# Altium schematic sheet Perifericos.SchDoc
size A4; SheetNumber: 6; SheetTotal: 6
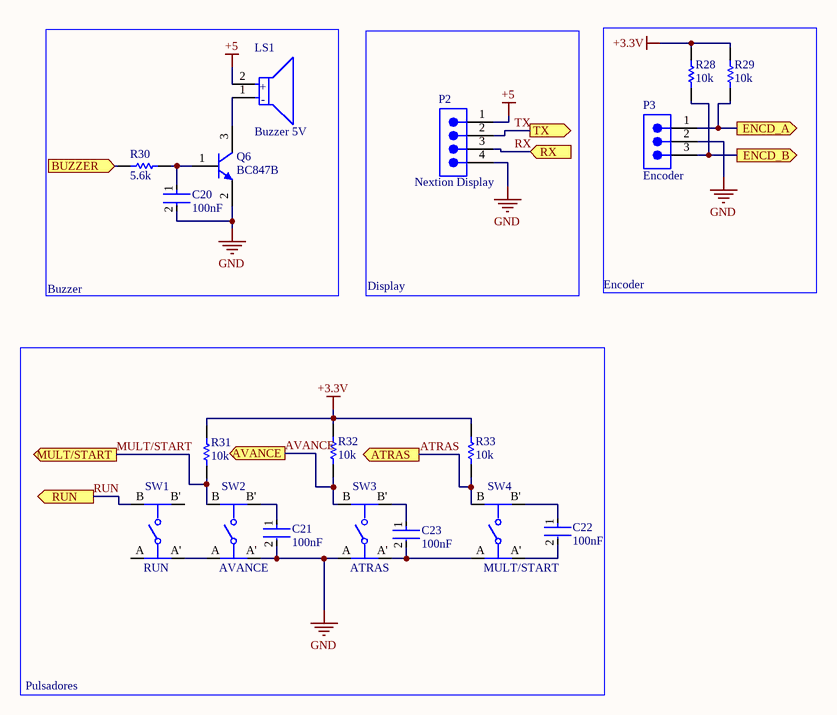
[diagram p0: Perifericos.SchDoc]

## Parts
C20  100nF  [FP-0805-L_2_01_0_2-W_1_25-IPC_B]
C21  100nF  [FP-0805-L_2_01_0_2-W_1_25-IPC_B]
C22  100nF  [FP-0805-L_2_01_0_2-W_1_25-IPC_B]
C23  100nF  [FP-0805-L_2_01_0_2-W_1_25-IPC_B]
LS1  Buzzer 5V  [FP-SDC1610M5-01-MFG]
P2  Nextion Display  [61300411121]
P3  Encoder  [61300311121]
Q6  BC847B  [INF-SOT23_M]
R28  10k  [RESC2013X50X30LL20T20]
R29  10k  [RESC2013X50X30LL20T20]
R30  5.6k  [RESC2013X50X30NL20T20]
R31  10k  [RESC2013X50X30LL20T20]
R32  10k  [RESC2013X50X30LL20T20]
R33  10k  [RESC2013X50X30LL20T20]
SW1  RUN  [FP-EVQ-PAC07K-MFG]
SW2  AVANCE  [FP-EVQ-PAC07K-MFG]
SW3  ATRAS  [FP-EVQ-PAC07K-MFG]
SW4  MULT/START  [FP-EVQ-PAC07K-MFG]

## Blocks framed on the sheet
Buzzer: C20 LS1 Q6 R30
Display: P2
Encoder: P3 R28 R29
Pulsadores: C21-C23 R31-R33 SW1-SW4

## Ports
ATRAS (out), AVANCE (out), BUZZER (in), ENCD_A (out), ENCD_B (out), MULT/START (out), RUN (out), RX (in), TX (out)

## Nets
+3.3V: R28.2 R29.2 R31.2 R32.2 R33.2
+5: LS1.2(A) P2.1
GND: C20.2 C21.2 P2.4 P3.2 Q6.2(E) SW2.A' SW3.A
ATRAS: R33.1 SW4.B ; port ATRAS
AVANCE: R32.1 SW3.B ; port AVANCE
BUZZER: R30.1 ; port BUZZER
ENCD_A: P3.1 R29.1 ; port ENCD_A
ENCD_B: P3.3 R28.1 ; port ENCD_B
MULT/START: R31.1 SW2.B ; port MULT/START
RUN: SW1.B ; port RUN
RX: P2.3 ; port RX
TX: P2.2 ; port TX
NetC20_1: C20.1 Q6.1(B) R30.2
NetC21_1: C21.1 SW2.B'
NetC22_1: C22.1 SW4.B'
NetC22_2: C22.2 SW4.A'
NetC23_1: C23.1 SW3.B'
NetC23_2: C23.2 SW3.A' SW4.A
NetLS1_1: LS1.1(C) Q6.3(C)
NetSW1_A': SW1.A' SW2.A

Not connected (* = marked no-connect by the designer): SW1 A B'

## Notes on the sheet
- (in symbol CMP-08413-000008-1) +; -

## Library data of the parts
C20-C23 = CMP-2007-04174-2: General Purpose Ceramic Capacitor, 0805, 100nF, 10%, X7R, 15%, 100V; Packaging: Tape and Reel; Min Operating Temperature: -55°C; Dielectric Material: Ceramic; Height: 1.4mm; Voltage Rating: 100V; Termination: SMD/SMT; Case Code (Imperial): 0805; Case Code (Metric): 2012; Case/Package: 0805; Construction: Flat; Radiation Hardening: No; Series: -; Dielectric: X7R; Package Quantity: 2000; Mount: Surface Mount; Capacitance: 100nF; Contact Plating: Tin; Voltage: 100V; Lead Free: Lead Free; Depth: 1.25mm; RoHS Compliant: Yes; Number of Pins: 2; Max Operating Temperature: 125°C; Length: 2.01mm; Voltage Rating (DC): 100V; Thickness: 0.055inch; REACH SVHC: No SVHC; Width: 0.049inch; Tolerance: 10%
LS1 = CMP-08413-000008-1: AUDIO MAGNETIC INDICATOR 4-8V TH; Input Type: DC; Max Supply Current: 30mA; Number of Terminals/Pins: 2; Frequency: 2.4kHz; Nominal Supply Voltage (DC): 5V; Lead Free: Lead Free; Operating Supply Current: 30mA; Sensing Method: Magnetic; Termination: PC Pins; Number of Pins: 2; Mount: Through Hole; Min Operating Temperature: -10°C; Diameter: 16mm; Series: SDC; Max Operating Temperature: 70°C; Packaging: Tray; Voltage Rating: 5V; Height: 10mm
P2 = CMP-1502-01064-3: NexarPartId: 32855522; Operating Supply Voltage: 250V; Pitch: 2.54mm; Contact Resistance: 20mΩ; Number of Positions: 4; Current Rating: 3A; Connector Type: Male Pin; Gender: Male; Contact Plating: Gold; Height: 8.89mm; Lead Pitch: 2.54mm; Lead Free: Lead Free; Contact Mating Length: 5.9944mm; Number of Rows: 1; Termination: Solder; Packaging: Bulk; REACH SVHC: Unknown; Min Operating Temperature: -40°C; RoHS: Compliant; Number of Contacts: 4; Voltage Rating: 250V; Color: Black; Max Operating Temperature: 105°C; Contact Material: Copper; Mount: Through Hole; Orientation: Vertical; Number of Pins: 4
P3 = CMP-1502-01062-3: NexarPartId: 32855521; Current Rating: 3A; Voltage Rating: 250V; Number of Positions: 3; Pitch: 2.54mm; Contact Resistance: 20mΩ; Connector Type: Male Pin; Gender: Male; REACH SVHC: Unknown; Packaging: Bulk; Contact Material: Copper; Min Operating Temperature: -40°C; Number of Rows: 1; Orientation: Vertical; RoHS: Compliant; Contact Plating: Gold; Max Operating Temperature: 105°C; Mount: Through Hole; Height: 8.94mm; Operating Supply Voltage: 250V; Number of Pins: 3; Contact Mating Length: 5.9944mm; Number of Contacts: 3; Color: Black; Lead Free: Lead Free; Lead Pitch: 2.54mm; Termination: Solder
Q6 = CMP-1177-00042-1: NPN Silicon AF Transistor, 45 V VCEO, 100 mA IC, SOT23, Reel, Green; Manufacturer: Infineon; VEBO (max): 6Â V; ICBO (max): 15Â nA; VCBO (max): 50Â V; IBM (max): 200Â mA; Green: TRUE; Ptot (max): 330Â mW; fT (typ): 250Â MHz; IC (max): 100Â mA; VCEO (max): 45Â V; PackageDescription: 3-Pin Small Outline Transistor Package, 1.3 x 2.9 mm Body, 0.95 mm Pitch; ComponentLink3URL: http://www.infineon.com/dgdl/SOT23-Package_Overview.pdf?folderId=db3a30431936bc4b0119532290053c66&fileId=db3a30431936bc4b0119533468123c85; PackageVersion: Apr-08; Packing: Reel; ComponentLink3Description: Package Specification; ComponentLink2URL: http://www.infineon.com/dgdl/bc847series_bc848series_bc849series_bc850series.pdf?folderId=db3a304314dca389011541d30fa21656&fileId=db3a304314dca389011541d4630a1657; ComponentLink1URL: http://www.infineon.com/; ComponentLink2Description: Datasheet; Polarity: NPN; Mounting Technology: Surface Mount; PackageReference: SOT23; ICM (max): 200Â mA; ComponentLink1Description: Manufacturer URL; PartNumber: BC847B
R28-R33 = CMP-2001-04896-1: Manufacturer: Vishay Dale; Part Number: CRCW08050000Z0EA
SW1-SW4 = CMP-00287-39841884-1: EVQ-PAC07K Switch Tactile N.O. SPST Round Button PC Pins 0.02A 15VDC 1N Thru-Hole Bulk; Max Current Rating: 20mA; Mechanical Life: 100kcycles; Contact Resistance: 50mΩ; Number of Positions: 2; Voltage Rating (DC): 15V; Actuator Length: 3.1mm; Illumination Type: Illuminated, Non-Illuminated; Switch Travel: 250µm; Switch Function: Off-Mom; Contact Plating: Gold, Silver; Max Operating Temperature: 70°C; Depth: 7.8mm; Min Operating Temperature: -20°C; Length: 6mm; Radiation Hardening: No; Mount: Through Hole; Operating Force: 1N; Height: 7mm; REACH SVHC: Unknown; Lead Free: Lead Free; Current Rating: 20mA; RoHS: Compliant; Contact Current Rating: 20mA; Width: 6mm; NexarPartId: 39841884; Electrical Life: 100kcycles; Termination: PC Pins; Packaging: Bulk; Life (Cycles): 100kcycles; Max Voltage Rating (DC): 15V; Orientation: Straight; Throw Configuration: SPST; Color: Black